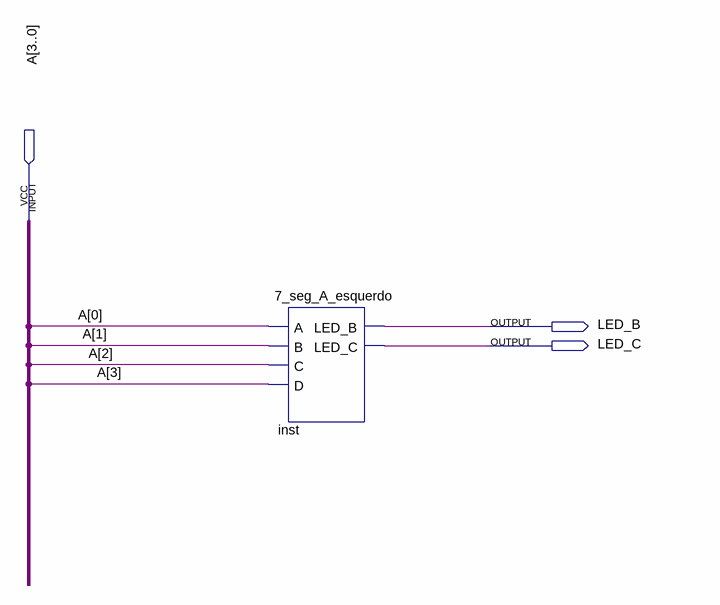
[diagram p0: schematic sheet]
// Quartus schematic 7_seg_A_esquerdo_conjunto.bdf as structural Verilog: 1 symbols, 3 pins
module \7_seg_A_esquerdo_conjunto  (
  input  [3:0] A,
  output LED_B,
  output LED_C
);

  \7_seg_A_esquerdo  inst (.A(A[0]), .B(A[1]), .C(A[2]), .D(A[3]), .LED_B(LED_B), .LED_C(LED_C));
endmodule
